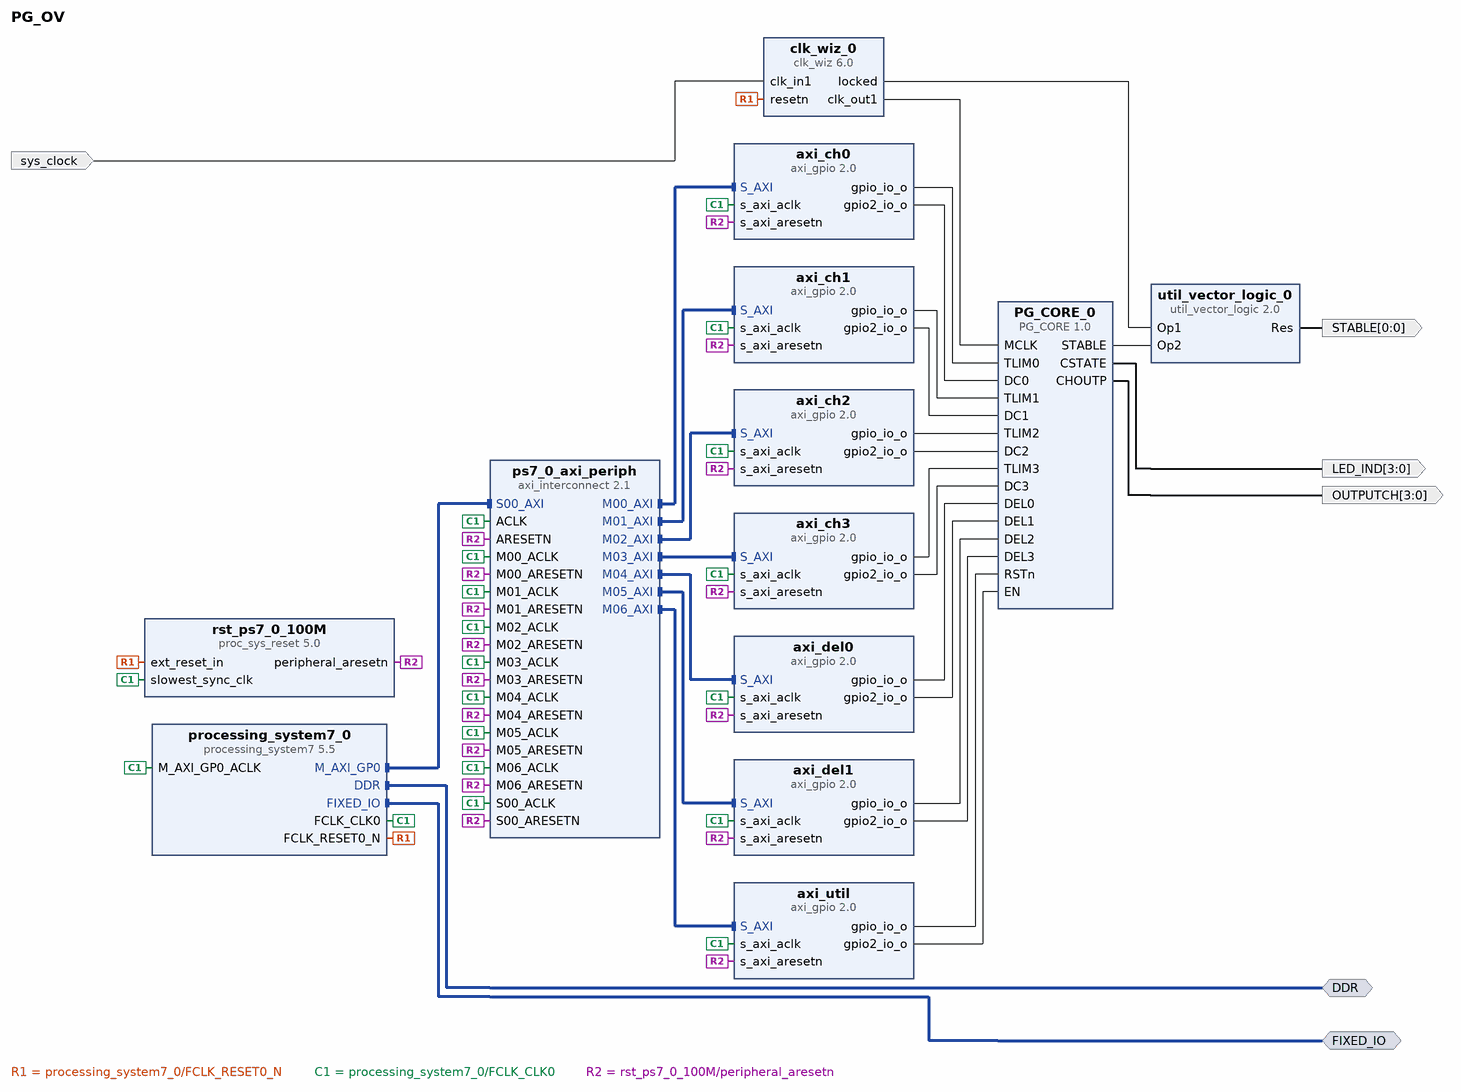
[diagram p0: block diagram of the top level]
# Vivado block design PG_OV, xc7z020clg400-1, Vivado 2019.1
create_bd_design PG_OV

create_bd_intf_port -mode Master -vlnv xilinx.com:interface:ddrx_rtl:1.0 DDR
create_bd_intf_port -mode Master -vlnv xilinx.com:display_processing_system7:fixedio_rtl:1.0 FIXED_IO
create_bd_port -dir I -type clk sys_clock
set_property -dict {CONFIG.FREQ_HZ 125000000 CONFIG.PHASE 0.000} [get_bd_ports sys_clock]
create_bd_port -dir O -from 3 -to 0 OUTPUTCH
create_bd_port -dir O -from 0 -to 0 STABLE
create_bd_port -dir O -from 3 -to 0 LED_IND

create_bd_cell -type ip -vlnv xilinx.com:ip:clk_wiz:6.0 clk_wiz_0
set_property -dict [list \
  CONFIG.CLKOUT1_DRIVES BUFG \
  CONFIG.CLKOUT1_JITTER 186.853 \
  CONFIG.CLKOUT1_PHASE_ERROR 249.865 \
  CONFIG.CLKOUT1_REQUESTED_OUT_FREQ 450.000 \
  CONFIG.CLKOUT2_DRIVES BUFG \
  CONFIG.CLKOUT3_DRIVES BUFG \
  CONFIG.CLKOUT4_DRIVES BUFG \
  CONFIG.CLKOUT5_DRIVES BUFG \
  CONFIG.CLKOUT6_DRIVES BUFG \
  CONFIG.CLKOUT7_DRIVES BUFG \
  CONFIG.CLK_IN1_BOARD_INTERFACE sys_clock \
  CONFIG.JITTER_SEL No_Jitter \
  CONFIG.MMCM_BANDWIDTH OPTIMIZED \
  CONFIG.MMCM_CLKFBOUT_MULT_F 36 \
  CONFIG.MMCM_CLKIN2_PERIOD 10.0 \
  CONFIG.MMCM_CLKOUT0_DIVIDE_F 2 \
  CONFIG.MMCM_COMPENSATION ZHOLD \
  CONFIG.MMCM_DIVCLK_DIVIDE 5 \
  CONFIG.PRIMITIVE PLL \
  CONFIG.RESET_PORT resetn \
  CONFIG.RESET_TYPE ACTIVE_LOW \
  CONFIG.USE_BOARD_FLOW true \
] [get_bd_cells clk_wiz_0]
create_bd_cell -type ip -vlnv xilinx.com:ip:processing_system7:5.5 processing_system7_0
set_property -dict [list \
  CONFIG.PCW_APU_PERIPHERAL_FREQMHZ 650 \
  CONFIG.PCW_CRYSTAL_PERIPHERAL_FREQMHZ 50 \
  CONFIG.PCW_ENET0_ENET0_IO {MIO 16 .. 27} \
  CONFIG.PCW_ENET0_GRP_MDIO_ENABLE 1 \
  CONFIG.PCW_ENET0_GRP_MDIO_IO {MIO 52 .. 53} \
  CONFIG.PCW_ENET0_PERIPHERAL_ENABLE 1 \
  CONFIG.PCW_ENET0_RESET_ENABLE 1 \
  CONFIG.PCW_ENET0_RESET_IO {MIO 9} \
  CONFIG.PCW_ENET_RESET_ENABLE 1 \
  CONFIG.PCW_ENET_RESET_SELECT {Share reset pin} \
  CONFIG.PCW_FPGA0_PERIPHERAL_FREQMHZ 100 \
  CONFIG.PCW_FPGA1_PERIPHERAL_FREQMHZ 50 \
  CONFIG.PCW_GPIO_MIO_GPIO_ENABLE 1 \
  CONFIG.PCW_GPIO_MIO_GPIO_IO MIO \
  CONFIG.PCW_I2C_RESET_ENABLE 1 \
  CONFIG.PCW_M_AXI_GP0_FREQMHZ 10 \
  CONFIG.PCW_PERIPHERAL_BOARD_PRESET None \
  CONFIG.PCW_PRESET_BANK1_VOLTAGE {LVCMOS 1.8V} \
  CONFIG.PCW_QSPI_GRP_FBCLK_ENABLE 1 \
  CONFIG.PCW_QSPI_GRP_FBCLK_IO {MIO 8} \
  CONFIG.PCW_QSPI_GRP_SINGLE_SS_ENABLE 1 \
  CONFIG.PCW_QSPI_GRP_SINGLE_SS_IO {MIO 1 .. 6} \
  CONFIG.PCW_QSPI_PERIPHERAL_ENABLE 1 \
  CONFIG.PCW_QSPI_QSPI_IO {MIO 1 .. 6} \
  CONFIG.PCW_SD0_GRP_CD_ENABLE 1 \
  CONFIG.PCW_SD0_GRP_CD_IO {MIO 47} \
  CONFIG.PCW_SD0_GRP_WP_ENABLE 0 \
  CONFIG.PCW_SD0_PERIPHERAL_ENABLE 1 \
  CONFIG.PCW_SD0_SD0_IO {MIO 40 .. 45} \
  CONFIG.PCW_SDIO_PERIPHERAL_FREQMHZ 50 \
  CONFIG.PCW_SINGLE_QSPI_DATA_MODE x4 \
  CONFIG.PCW_UART0_PERIPHERAL_ENABLE 1 \
  CONFIG.PCW_UART0_UART0_IO {MIO 14 .. 15} \
  CONFIG.PCW_UART1_PERIPHERAL_ENABLE 0 \
  CONFIG.PCW_UART_PERIPHERAL_FREQMHZ 100 \
  CONFIG.PCW_UIPARAM_DDR_BUS_WIDTH {16 Bit} \
  CONFIG.PCW_UIPARAM_DDR_FREQ_MHZ 525 \
  CONFIG.PCW_UIPARAM_DDR_PARTNO {MT41J256M16 RE-125} \
  CONFIG.PCW_USB0_PERIPHERAL_ENABLE 1 \
  CONFIG.PCW_USB0_RESET_ENABLE 1 \
  CONFIG.PCW_USB0_RESET_IO {MIO 46} \
  CONFIG.PCW_USB0_USB0_IO {MIO 28 .. 39} \
  CONFIG.PCW_USB_RESET_ENABLE 1 \
  CONFIG.PCW_USB_RESET_SELECT {Share reset pin} \
] [get_bd_cells processing_system7_0]
# 481 more settings of processing_system7_0 are not shown: defaults, MIO pin electricals, DDR timing, and values the tool derives
create_bd_cell -type ip -vlnv xilinx.com:ip:axi_gpio:2.0 axi_ch0
set_property -dict {CONFIG.C_ALL_OUTPUTS 1 CONFIG.C_ALL_OUTPUTS_2 1 CONFIG.C_IS_DUAL 1} [get_bd_cells axi_ch0]
create_bd_cell -type ip -vlnv xilinx.com:ip:axi_gpio:2.0 axi_ch1
set_property -dict {CONFIG.C_ALL_OUTPUTS 1 CONFIG.C_ALL_OUTPUTS_2 1 CONFIG.C_IS_DUAL 1} [get_bd_cells axi_ch1]
create_bd_cell -type ip -vlnv xilinx.com:ip:axi_gpio:2.0 axi_ch2
set_property -dict {CONFIG.C_ALL_OUTPUTS 1 CONFIG.C_ALL_OUTPUTS_2 1 CONFIG.C_IS_DUAL 1} [get_bd_cells axi_ch2]
create_bd_cell -type ip -vlnv xilinx.com:ip:axi_gpio:2.0 axi_ch3
set_property -dict {CONFIG.C_ALL_OUTPUTS 1 CONFIG.C_ALL_OUTPUTS_2 1 CONFIG.C_IS_DUAL 1} [get_bd_cells axi_ch3]
create_bd_cell -type ip -vlnv xilinx.com:ip:axi_gpio:2.0 axi_del0
set_property -dict {CONFIG.C_ALL_OUTPUTS 1 CONFIG.C_ALL_OUTPUTS_2 1 CONFIG.C_IS_DUAL 1} [get_bd_cells axi_del0]
create_bd_cell -type ip -vlnv xilinx.com:ip:axi_gpio:2.0 axi_del1
set_property -dict {CONFIG.C_ALL_OUTPUTS 1 CONFIG.C_ALL_OUTPUTS_2 1 CONFIG.C_IS_DUAL 1} [get_bd_cells axi_del1]
create_bd_cell -type ip -vlnv xilinx.com:ip:util_vector_logic:2.0 util_vector_logic_0
set_property -dict {CONFIG.C_SIZE 1} [get_bd_cells util_vector_logic_0]
create_bd_cell -type ip -vlnv xilinx.com:ip:axi_gpio:2.0 axi_util
set_property -dict [list \
  CONFIG.C_ALL_OUTPUTS 1 \
  CONFIG.C_ALL_OUTPUTS_2 1 \
  CONFIG.C_GPIO2_WIDTH 4 \
  CONFIG.C_GPIO_WIDTH 1 \
  CONFIG.C_IS_DUAL 1 \
] [get_bd_cells axi_util]
create_bd_cell -type ip -vlnv xilinx.com:ip:axi_interconnect:2.1 ps7_0_axi_periph
set_property -dict {CONFIG.NUM_MI 7} [get_bd_cells ps7_0_axi_periph]
create_bd_cell -type ip -vlnv xilinx.com:ip:proc_sys_reset:5.0 rst_ps7_0_100M
create_bd_cell -type ip -vlnv cri.nz:user:PG_CORE:1.0 PG_CORE_0

# ---- connections ----

connect_bd_intf_net [get_bd_intf_pins processing_system7_0/M_AXI_GP0] [get_bd_intf_pins ps7_0_axi_periph/S00_AXI]
connect_bd_intf_net [get_bd_intf_pins ps7_0_axi_periph/M00_AXI] [get_bd_intf_pins axi_ch0/S_AXI]
connect_bd_intf_net [get_bd_intf_pins ps7_0_axi_periph/M01_AXI] [get_bd_intf_pins axi_ch1/S_AXI]
connect_bd_intf_net [get_bd_intf_pins ps7_0_axi_periph/M02_AXI] [get_bd_intf_pins axi_ch2/S_AXI]
connect_bd_intf_net [get_bd_intf_pins ps7_0_axi_periph/M03_AXI] [get_bd_intf_pins axi_ch3/S_AXI]
connect_bd_intf_net [get_bd_intf_pins ps7_0_axi_periph/M04_AXI] [get_bd_intf_pins axi_del0/S_AXI]
connect_bd_intf_net [get_bd_intf_pins ps7_0_axi_periph/M05_AXI] [get_bd_intf_pins axi_del1/S_AXI]
connect_bd_intf_net [get_bd_intf_pins ps7_0_axi_periph/M06_AXI] [get_bd_intf_pins axi_util/S_AXI]
connect_bd_intf_net [get_bd_intf_ports DDR] [get_bd_intf_pins processing_system7_0/DDR]
connect_bd_intf_net [get_bd_intf_ports FIXED_IO] [get_bd_intf_pins processing_system7_0/FIXED_IO]
connect_bd_net [get_bd_ports sys_clock] [get_bd_pins clk_wiz_0/clk_in1]
connect_bd_net [get_bd_pins axi_ch0/gpio_io_o] [get_bd_pins PG_CORE_0/TLIM0]
connect_bd_net [get_bd_pins axi_ch0/gpio2_io_o] [get_bd_pins PG_CORE_0/DC0]
connect_bd_net [get_bd_pins axi_ch1/gpio_io_o] [get_bd_pins PG_CORE_0/TLIM1]
connect_bd_net [get_bd_pins axi_ch1/gpio2_io_o] [get_bd_pins PG_CORE_0/DC1]
connect_bd_net [get_bd_pins axi_ch2/gpio_io_o] [get_bd_pins PG_CORE_0/TLIM2]
connect_bd_net [get_bd_pins axi_ch2/gpio2_io_o] [get_bd_pins PG_CORE_0/DC2]
connect_bd_net [get_bd_pins axi_ch3/gpio_io_o] [get_bd_pins PG_CORE_0/TLIM3]
connect_bd_net [get_bd_pins axi_ch3/gpio2_io_o] [get_bd_pins PG_CORE_0/DC3]
connect_bd_net [get_bd_pins axi_del0/gpio_io_o] [get_bd_pins PG_CORE_0/DEL0]
connect_bd_net [get_bd_pins axi_del0/gpio2_io_o] [get_bd_pins PG_CORE_0/DEL1]
connect_bd_net [get_bd_pins axi_del1/gpio_io_o] [get_bd_pins PG_CORE_0/DEL2]
connect_bd_net [get_bd_pins axi_del1/gpio2_io_o] [get_bd_pins PG_CORE_0/DEL3]
connect_bd_net [get_bd_pins clk_wiz_0/clk_out1] [get_bd_pins PG_CORE_0/MCLK]
connect_bd_net [get_bd_pins clk_wiz_0/locked] [get_bd_pins util_vector_logic_0/Op1]
connect_bd_net [get_bd_pins PG_CORE_0/STABLE] [get_bd_pins util_vector_logic_0/Op2]
connect_bd_net -net PG_CORE_0_OUTPUT [get_bd_pins PG_CORE_0/CHOUTP] [get_bd_ports OUTPUTCH]
connect_bd_net [get_bd_pins util_vector_logic_0/Res] [get_bd_ports STABLE]
connect_bd_net [get_bd_pins axi_util/gpio_io_o] [get_bd_pins PG_CORE_0/RSTn]
connect_bd_net [get_bd_pins axi_util/gpio2_io_o] [get_bd_pins PG_CORE_0/EN]
connect_bd_net [get_bd_pins processing_system7_0/FCLK_RESET0_N] [get_bd_pins clk_wiz_0/resetn] [get_bd_pins rst_ps7_0_100M/ext_reset_in]
connect_bd_net [get_bd_pins processing_system7_0/FCLK_CLK0] \
  [get_bd_pins processing_system7_0/M_AXI_GP0_ACLK] [get_bd_pins ps7_0_axi_periph/S00_ACLK] \
  [get_bd_pins rst_ps7_0_100M/slowest_sync_clk] [get_bd_pins axi_ch0/s_axi_aclk] [get_bd_pins ps7_0_axi_periph/M00_ACLK] \
  [get_bd_pins ps7_0_axi_periph/ACLK] [get_bd_pins axi_ch1/s_axi_aclk] [get_bd_pins ps7_0_axi_periph/M01_ACLK] \
  [get_bd_pins axi_ch2/s_axi_aclk] [get_bd_pins ps7_0_axi_periph/M02_ACLK] [get_bd_pins axi_ch3/s_axi_aclk] \
  [get_bd_pins ps7_0_axi_periph/M03_ACLK] [get_bd_pins axi_del0/s_axi_aclk] [get_bd_pins ps7_0_axi_periph/M04_ACLK] \
  [get_bd_pins axi_del1/s_axi_aclk] [get_bd_pins ps7_0_axi_periph/M05_ACLK] [get_bd_pins axi_util/s_axi_aclk] \
  [get_bd_pins ps7_0_axi_periph/M06_ACLK]
connect_bd_net [get_bd_pins rst_ps7_0_100M/peripheral_aresetn] \
  [get_bd_pins ps7_0_axi_periph/S00_ARESETN] [get_bd_pins axi_ch0/s_axi_aresetn] [get_bd_pins ps7_0_axi_periph/M00_ARESETN] \
  [get_bd_pins ps7_0_axi_periph/ARESETN] [get_bd_pins axi_ch1/s_axi_aresetn] [get_bd_pins ps7_0_axi_periph/M01_ARESETN] \
  [get_bd_pins axi_ch2/s_axi_aresetn] [get_bd_pins ps7_0_axi_periph/M02_ARESETN] [get_bd_pins axi_ch3/s_axi_aresetn] \
  [get_bd_pins ps7_0_axi_periph/M03_ARESETN] [get_bd_pins axi_del0/s_axi_aresetn] [get_bd_pins ps7_0_axi_periph/M04_ARESETN] \
  [get_bd_pins axi_del1/s_axi_aresetn] [get_bd_pins ps7_0_axi_periph/M05_ARESETN] [get_bd_pins axi_util/s_axi_aresetn] \
  [get_bd_pins ps7_0_axi_periph/M06_ARESETN]
connect_bd_net [get_bd_pins PG_CORE_0/CSTATE] [get_bd_ports LED_IND]

# ---- address map ----
assign_bd_address -offset 0x41200000 -range 64K -target_address_space [get_bd_addr_spaces processing_system7_0/Data] [get_bd_addr_segs axi_ch0/S_AXI/Reg]
assign_bd_address -offset 0x41210000 -range 64K -target_address_space [get_bd_addr_spaces processing_system7_0/Data] [get_bd_addr_segs axi_ch1/S_AXI/Reg]
assign_bd_address -offset 0x41220000 -range 64K -target_address_space [get_bd_addr_spaces processing_system7_0/Data] [get_bd_addr_segs axi_ch2/S_AXI/Reg]
assign_bd_address -offset 0x41230000 -range 64K -target_address_space [get_bd_addr_spaces processing_system7_0/Data] [get_bd_addr_segs axi_ch3/S_AXI/Reg]
assign_bd_address -offset 0x41240000 -range 64K -target_address_space [get_bd_addr_spaces processing_system7_0/Data] [get_bd_addr_segs axi_del0/S_AXI/Reg]
assign_bd_address -offset 0x41250000 -range 64K -target_address_space [get_bd_addr_spaces processing_system7_0/Data] [get_bd_addr_segs axi_del1/S_AXI/Reg]
assign_bd_address -offset 0x41260000 -range 64K -target_address_space [get_bd_addr_spaces processing_system7_0/Data] [get_bd_addr_segs axi_util/S_AXI/Reg]

validate_bd_design
save_bd_design
